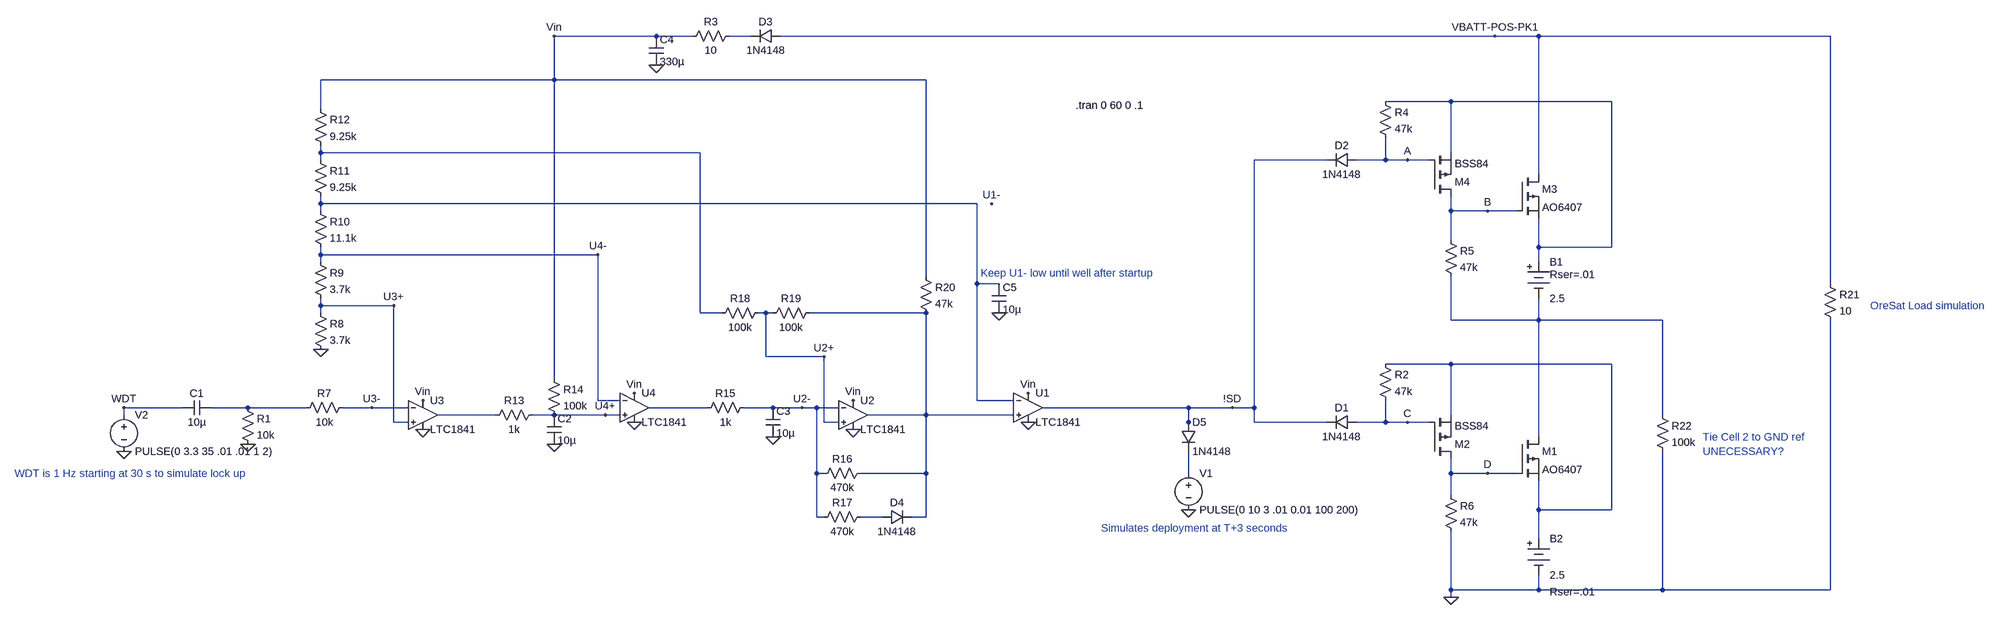
[diagram p0: schematic WDT-C3V5-simulation-LTSpice-XVII.asc]
WDT-C3V5-simulation-LTSpice-XVII.asc, the LTspice schematic file:
Version 4
SHEET 1 1452 1152
WIRE -2256 -624 -2480 -624
WIRE -2176 -624 -2256 -624
WIRE -2048 -624 -2096 -624
WIRE -416 -624 -1984 -624
WIRE -320 -624 -416 -624
WIRE 320 -624 -320 -624
WIRE -2480 -528 -2480 -624
WIRE -2480 -528 -2992 -528
WIRE -1664 -528 -2480 -528
WIRE -512 -480 -656 -480
WIRE -160 -480 -512 -480
WIRE -2992 -464 -2992 -528
WIRE -2992 -368 -2992 -384
WIRE -2160 -368 -2992 -368
WIRE -512 -368 -512 -480
WIRE -2992 -352 -2992 -368
WIRE -784 -352 -944 -352
WIRE -656 -352 -656 -400
WIRE -656 -352 -720 -352
WIRE -608 -352 -656 -352
WIRE -560 -352 -608 -352
WIRE -320 -320 -320 -624
WIRE -2992 -256 -2992 -272
WIRE -1552 -256 -2992 -256
WIRE -2992 -240 -2992 -256
WIRE -512 -240 -512 -272
WIRE -432 -240 -512 -240
WIRE -368 -240 -432 -240
WIRE -512 -176 -512 -240
WIRE -320 -160 -320 -224
WIRE -160 -160 -160 -480
WIRE -160 -160 -320 -160
WIRE -2992 -144 -2992 -160
WIRE -2384 -144 -2992 -144
WIRE -2992 -128 -2992 -144
WIRE -320 -128 -320 -160
WIRE -1664 -96 -1664 -528
WIRE -1552 -80 -1552 -256
WIRE -1504 -80 -1552 -80
WIRE 320 -80 320 -624
WIRE -2992 -32 -2992 -48
WIRE -2832 -32 -2992 -32
WIRE -2992 -16 -2992 -32
WIRE -2160 -16 -2160 -368
WIRE -2112 -16 -2160 -16
WIRE -2016 -16 -2032 -16
WIRE -2000 -16 -2016 -16
WIRE -1664 -16 -1920 -16
WIRE -512 0 -512 -96
WIRE -320 0 -320 -48
WIRE -320 0 -512 0
WIRE -48 0 -320 0
WIRE -2016 80 -2016 -16
WIRE -1888 80 -2016 80
WIRE -512 96 -656 96
WIRE -160 96 -512 96
WIRE -2480 128 -2480 -528
WIRE -2384 176 -2384 -144
WIRE -2336 176 -2384 176
WIRE -1552 176 -1552 -80
WIRE -1472 176 -1552 176
WIRE -3296 192 -3424 192
WIRE -3152 192 -3232 192
WIRE -3024 192 -3152 192
WIRE -2880 192 -2944 192
WIRE -2800 192 -2880 192
WIRE -2144 192 -2272 192
WIRE -2000 192 -2064 192
WIRE -1936 192 -2000 192
WIRE -1904 192 -1936 192
WIRE -1856 192 -1904 192
WIRE -1088 192 -1408 192
WIRE -992 192 -1088 192
WIRE -944 192 -944 -352
WIRE -944 192 -992 192
WIRE -3424 208 -3424 192
WIRE -2608 208 -2736 208
WIRE -2480 208 -2528 208
WIRE -2368 208 -2480 208
WIRE -2336 208 -2368 208
WIRE -1664 208 -1664 -16
WIRE -1664 208 -1792 208
WIRE -1472 208 -1664 208
WIRE -512 208 -512 96
WIRE -48 208 -48 0
WIRE -2832 224 -2832 -32
WIRE -2800 224 -2832 224
WIRE -1888 224 -1888 80
WIRE -1856 224 -1888 224
WIRE -1088 224 -1088 192
WIRE -944 224 -944 192
WIRE -784 224 -944 224
WIRE -656 224 -656 176
WIRE -656 224 -720 224
WIRE -608 224 -656 224
WIRE -560 224 -608 224
WIRE -1088 240 -1088 224
WIRE -320 256 -320 0
WIRE -1904 336 -1904 192
WIRE -1888 336 -1904 336
WIRE -1664 336 -1664 208
WIRE -1664 336 -1808 336
WIRE -1088 336 -1088 288
WIRE -512 336 -512 304
WIRE -432 336 -512 336
WIRE -368 336 -432 336
WIRE -512 384 -512 336
WIRE -320 416 -320 352
WIRE -160 416 -160 96
WIRE -160 416 -320 416
WIRE -1904 432 -1904 336
WIRE -1888 432 -1904 432
WIRE -1760 432 -1808 432
WIRE -1664 432 -1664 336
WIRE -1664 432 -1696 432
WIRE -320 480 -320 416
WIRE -512 592 -512 464
WIRE -320 592 -320 560
WIRE -320 592 -512 592
WIRE -48 592 -48 288
WIRE -48 592 -320 592
WIRE 320 592 320 0
WIRE 320 592 -48 592
WIRE -512 608 -512 592
FLAG -416 -624 VBATT-POS-PK1
FLAG -992 192 !SD
FLAG -512 608 0
FLAG -3424 288 0
FLAG -3424 192 WDT
FLAG -608 -352 A
FLAG -432 -240 B
FLAG -608 224 C
FLAG -432 336 D
FLAG -3152 272 0
FLAG -2768 240 0
FLAG -2304 224 0
FLAG -1824 240 0
FLAG -1440 224 0
FLAG -2992 64 0
FLAG -2480 272 0
FLAG -2000 256 0
FLAG -2832 -32 U3+
FLAG -2384 -144 U4-
FLAG -1888 80 U2+
FLAG -1520 -256 U1-
FLAG -2880 192 U3-
FLAG -2368 208 U4+
FLAG -1936 192 U2-
FLAG -2768 176 Vin
FLAG -2304 160 Vin
FLAG -1824 176 Vin
FLAG -1440 160 Vin
FLAG -2480 -624 Vin
FLAG -1088 416 0
FLAG -2256 -560 0
FLAG -1504 -16 0
SYMBOL pmos -368 256 R0
SYMATTR InstName M1
SYMATTR Value AO6407
SYMBOL pmos -560 304 M180
SYMATTR InstName M2
SYMATTR Value BSS84
SYMBOL pmos -368 -320 R0
SYMATTR InstName M3
SYMATTR Value AO6407
SYMBOL pmos -560 -272 M180
SYMATTR InstName M4
SYMATTR Value BSS84
SYMBOL res -672 -496 R0
SYMATTR InstName R4
SYMATTR Value 47k
SYMBOL res -528 -192 R0
SYMATTR InstName R5
SYMATTR Value 47k
SYMBOL diode -720 -368 R90
WINDOW 0 0 32 VBottom 2
WINDOW 3 32 32 VTop 2
SYMATTR InstName D2
SYMATTR Value 1N4148
SYMBOL Misc\\battery -320 -144 R0
WINDOW 123 0 0 Left 0
WINDOW 39 24 44 Left 2
SYMATTR SpiceLine Rser=.01
SYMATTR InstName B1
SYMATTR Value 2.5
SYMBOL diode -720 208 R90
WINDOW 0 0 32 VBottom 2
WINDOW 3 32 32 VTop 2
SYMATTR InstName D1
SYMATTR Value 1N4148
SYMBOL Comparators\\LTC1841 -1440 192 R0
SYMATTR InstName U1
SYMBOL Comparators\\LTC1841 -1824 208 R0
SYMATTR InstName U2
SYMBOL Comparators\\LTC1841 -2768 208 R0
SYMATTR InstName U3
SYMBOL Comparators\\LTC1841 -2304 192 R0
SYMATTR InstName U4
SYMBOL diode -1984 -640 R90
WINDOW 0 0 32 VBottom 2
WINDOW 3 32 32 VTop 2
SYMATTR InstName D3
SYMATTR Value 1N4148
SYMBOL res -672 80 R0
SYMATTR InstName R2
SYMATTR Value 47k
SYMBOL res -528 368 R0
SYMATTR InstName R6
SYMATTR Value 47k
SYMBOL Misc\\battery -320 464 R0
WINDOW 123 0 0 Left 0
WINDOW 39 24 132 Left 2
SYMATTR SpiceLine Rser=.01
SYMATTR InstName B2
SYMATTR Value 2.5
SYMBOL cap -3232 176 R90
WINDOW 0 0 32 VBottom 2
WINDOW 3 32 32 VTop 2
SYMATTR InstName C1
SYMATTR Value 10µ
SYMBOL res -3168 176 R0
SYMATTR InstName R1
SYMATTR Value 10k
SYMBOL res -2928 176 R90
WINDOW 0 0 56 VBottom 2
WINDOW 3 32 56 VTop 2
SYMATTR InstName R7
SYMATTR Value 10k
SYMBOL res -3008 -32 R0
SYMATTR InstName R8
SYMATTR Value 3.7k
SYMBOL res -3008 -144 R0
SYMATTR InstName R9
SYMATTR Value 3.7k
SYMBOL res -3008 -256 R0
SYMATTR InstName R10
SYMATTR Value 11.1k
SYMBOL res -3008 -368 R0
SYMATTR InstName R11
SYMATTR Value 9.25k
SYMBOL res -3008 -480 R0
SYMATTR InstName R12
SYMATTR Value 9.25k
SYMBOL res -2512 192 R90
WINDOW 0 0 56 VBottom 2
WINDOW 3 32 56 VTop 2
SYMATTR InstName R13
SYMATTR Value 1k
SYMBOL cap -2496 208 R0
SYMATTR InstName C2
SYMATTR Value 10µ
SYMBOL res -2496 112 R0
SYMATTR InstName R14
SYMATTR Value 100k
SYMBOL res -2048 176 R90
WINDOW 0 0 56 VBottom 2
WINDOW 3 32 56 VTop 2
SYMATTR InstName R15
SYMATTR Value 1k
SYMBOL cap -2016 192 R0
SYMATTR InstName C3
SYMATTR Value 10µ
SYMBOL res -1792 320 R90
WINDOW 0 0 56 VBottom 2
WINDOW 3 32 56 VTop 2
SYMATTR InstName R16
SYMATTR Value 470k
SYMBOL res -1792 416 R90
WINDOW 0 0 56 VBottom 2
WINDOW 3 32 56 VTop 2
SYMATTR InstName R17
SYMATTR Value 470k
SYMBOL res -2016 -32 R90
WINDOW 0 0 56 VBottom 2
WINDOW 3 32 56 VTop 2
SYMATTR InstName R18
SYMATTR Value 100k
SYMBOL res -1904 -32 R90
WINDOW 0 0 56 VBottom 2
WINDOW 3 32 56 VTop 2
SYMATTR InstName R19
SYMATTR Value 100k
SYMBOL res -1680 -112 R0
SYMATTR InstName R20
SYMATTR Value 47k
SYMBOL diode -1760 448 R270
WINDOW 0 32 32 VTop 2
WINDOW 3 0 32 VBottom 2
SYMATTR InstName D4
SYMATTR Value 1N4148
SYMBOL voltage -1088 320 R0
WINDOW 123 0 0 Left 0
WINDOW 39 0 0 Left 0
SYMATTR InstName V1
SYMATTR Value PULSE(0 10 3 .01 0.01 100 200)
SYMBOL diode -1104 224 R0
SYMATTR InstName D5
SYMATTR Value 1N4148
SYMBOL res -2080 -640 R90
WINDOW 0 0 56 VBottom 2
WINDOW 3 32 56 VTop 2
SYMATTR InstName R3
SYMATTR Value 10
SYMBOL cap -2272 -624 R0
SYMATTR InstName C4
SYMATTR Value 330µ
SYMATTR SpiceLine V=20
SYMBOL cap -1520 -80 R0
SYMATTR InstName C5
SYMATTR Value 10µ
SYMBOL voltage -3424 192 R0
WINDOW 123 0 0 Left 0
WINDOW 39 0 0 Left 0
SYMATTR InstName V2
SYMATTR Value PULSE(0 3.3 35 .01 .01 1 2)
SYMBOL res 304 -96 R0
SYMATTR InstName R21
SYMATTR Value 10
SYMBOL res -64 192 R0
SYMATTR InstName R22
SYMATTR Value 100k
TEXT -1336 -472 Left 2 !.tran 0 60 0 .1
TEXT 408 -32 Left 2 ;OreSat Load simulation
TEXT 40 256 Left 2 ;Tie Cell 2 to GND ref
TEXT -1280 456 Left 2 ;Simulates deployment at T+3 seconds
TEXT -3664 336 Left 2 ;WDT is 1 Hz starting at 30 s to simulate lock up
TEXT 40 288 Left 2 ;UNECESSARY?
TEXT -1544 -104 Left 2 ;Keep U1- low until well after startup

The netlist it stands for:
* WDT-C3V5-simulation-LTSpice-XVII.asc
M1 N006 D N007 N007 AO6407
M2 D C N007 N007 BSS84
M3 VBATT-POS-PK1 B N002 N002 AO6407
M4 B A N002 N002 BSS84
R4 N002 A 47k
R5 B N006 47k
D2 A !SD 1N4148
V§B1 N002 N006 2.5 Rser=.01
D1 C !SD 1N4148
* U1: LTC1841 (symbol Comparators\LTC1841 not available, pins judged from their places): In+=N005 In-=N004 V+=Vin V-=0 OUT=!SD
* U2: LTC1841 (symbol Comparators\LTC1841 not available, pins judged from their places): In+=U2+ In-=U2- V+=Vin V-=0 OUT=N005
* U3: LTC1841 (symbol Comparators\LTC1841 not available, pins judged from their places): In+=U3+ In-=U3- V+=Vin V-=0 OUT=N010
* U4: LTC1841 (symbol Comparators\LTC1841 not available, pins judged from their places): In+=U4+ In-=U4- V+=Vin V-=0 OUT=N009
D3 VBATT-POS-PK1 N001 1N4148
R2 N007 C 47k
R6 D 0 47k
V§B2 N007 0 2.5 Rser=.01
C1 N008 WDT 10µ
R1 N008 0 10k
R7 U3- N008 10k
R8 U3+ 0 3.7k
R9 U4- U3+ 3.7k
R10 N004 U4- 11.1k
R11 N003 N004 9.25k
R12 Vin N003 9.25k
R13 U4+ N010 1k
C2 U4+ 0 10µ
R14 Vin U4+ 100k
R15 U2- N009 1k
C3 U2- 0 10µ
R16 N005 U2- 470k
R17 N012 U2- 470k
R18 U2+ N003 100k
R19 N005 U2+ 100k
R20 Vin N005 47k
D4 N012 N005 1N4148
V1 N011 0 PULSE(0 10 3 .01 0.01 100 200)
D5 !SD N011 1N4148
R3 N001 Vin 10
C4 Vin 0 330µ V=20
C5 N004 0 10µ
V2 WDT 0 PULSE(0 3.3 35 .01 .01 1 2)
R21 VBATT-POS-PK1 0 10
R22 N006 0 100k
.model D D
.lib standard.dio
.model NMOS NMOS
.model PMOS PMOS
.lib standard.mos
.tran 0 60 0 .1
* OreSat Load simulation
* Tie Cell 2 to GND ref
* Simulates deployment at T+3 seconds
* WDT is 1 Hz starting at 30 s to simulate lock up
* UNECESSARY?
* Keep U1- low until well after startup
.backanno
.end